# EAGLE design High Current Board (EAGLE 9.2.2)
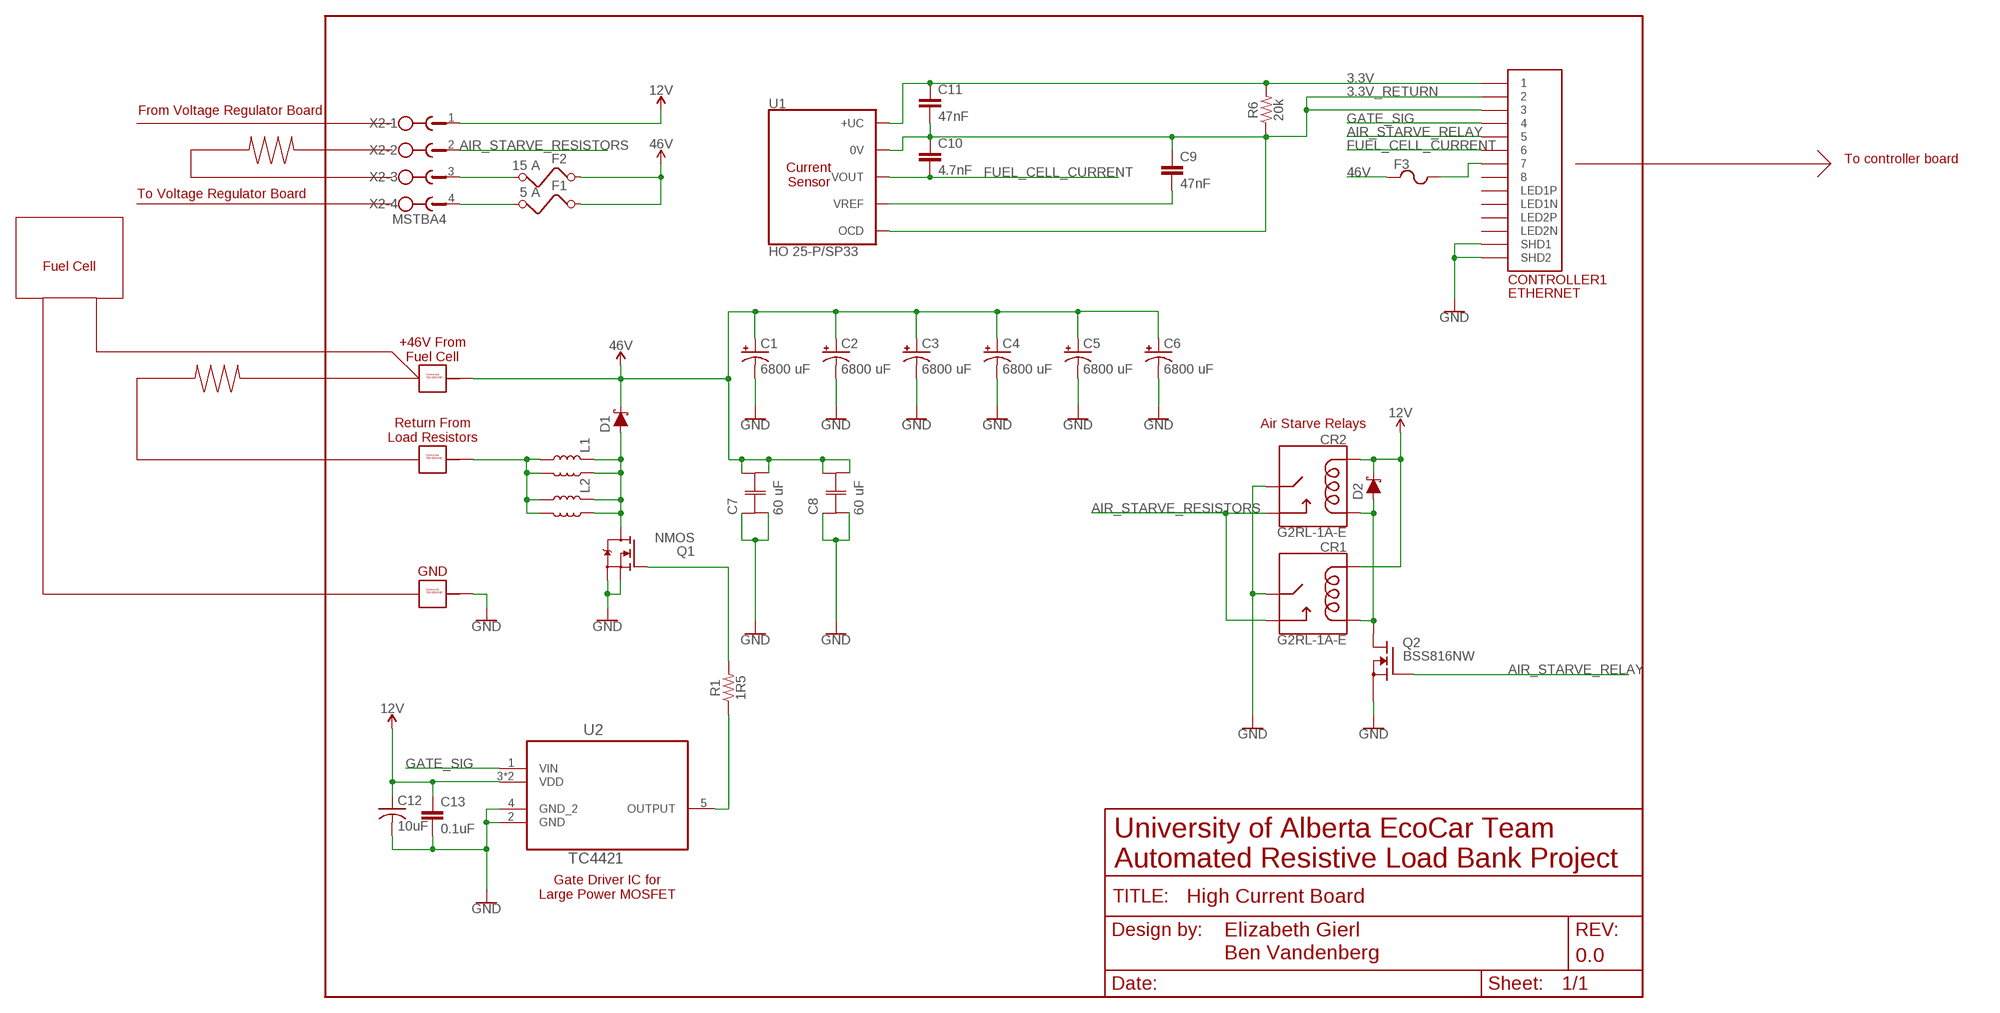
[diagram p0: schematic, sheet 1]

## Parts
C1  6800 uF  C-POL-RADIAL-10MM-35MM  [CPOL-RADIAL-10MM-35MM]
C2  6800 uF  C-POL-RADIAL-10MM-35MM  [CPOL-RADIAL-10MM-35MM]
C3  6800 uF  C-POL-RADIAL-10MM-35MM  [CPOL-RADIAL-10MM-35MM]
C4  6800 uF  C-POL-RADIAL-10MM-35MM  [CPOL-RADIAL-10MM-35MM]
C5  6800 uF  C-POL-RADIAL-10MM-35MM  [CPOL-RADIAL-10MM-35MM]
C6  6800 uF  C-POL-RADIAL-10MM-35MM  [CPOL-RADIAL-10MM-35MM]
C7  60 uF  C4ATDBW5600A30J  [C4A-0(60)]
C8  60 uF  C4ATDBW5600A30J  [C4A-0(60)]
C9  47nF  1.0UF-0805-25V-(+80/-20%)  [0805]
C10  4.7nF  1.0UF-0805-25V-(+80/-20%)  [0805]
C11  47nF  1.0UF-0805-25V-(+80/-20%)  [0805]
C12  10uF  C-USC0603  [C0603]
C13  0.1uF  1.0UF-0805-25V-(+80/-20%)  [0805]
CONTROLLER1  ETHERNET  [A122645-ND]
CR1  G2RL-1A-E  G2RL-1A-E_SPST_RELAY  [G2RL-1A-E_RELAY]
CR2  G2RL-1A-E  G2RL-1A-E_SPST_RELAY  [G2RL-1A-E_RELAY]
D1  VISHAY_VS-243NQ100PBF  [D-67_HALF-PAK]
D2  SOD-123F_SCHOTTKY  [SOD-123F]
F1  5 A  KEYSTONE_ATM_FUSEHOLDER  [KEYSTONE_ATM_FUSEHOLDER]
F2  15 A  KEYSTONE_ATM_FUSEHOLDER  [KEYSTONE_ATM_FUSEHOLDER]
F3  POLYFUSE  [1206]
FC.GND1  732-3204-ND_CONNECTOR  [732-3204-ND]
FC.GND2  732-3204-ND_CONNECTOR  [732-3204-ND]
FC.POS  732-3204-ND_CONNECTOR  [732-3204-ND]
FRAME1  FRAME-LETTERNO_PACKAGE  [DUMMY]
L1  CMX1616Z171B-10  [CMX1616Z171B-10]
L2  CMX1616Z171B-10  [CMX1616Z171B-10]
Q1  NMOS  VISHAY_BIG_MOSFET  [SOT-227]
Q2  BSS816NW  SOT323-NMOS  [SOT-323]
R1  1R5  R_SMD_2512  [SMD_2512]
R6  20k  0.3OHM-0805-1/8W-1%  [0805]
U1  HO 25-P/SP33  LEM_HO_25-P  [LEM_HO_25-P]
U2  TC4421  TC4421A-HORIZONTAL  [TO220-52]
X2  MSTBA4  [MSTBA4]

## Nets
3.3V: C11.1 CONTROLLER1.P$1 R6.2 U1.1(+UC)
3.3V_RETURN: C9.1 C10.1 C11.2 CONTROLLER1.P$2 CONTROLLER1.P$3 R6.1 U1.2(0V) U1.5(OCD)
12V: C12.1 C13.1 CR1.1(COIL1) CR2.1(COIL1) D2.C U2.3(VDD) U2.P$1(VDD) X2.1
46V: C1.+ C2.+ C3.+ C4.+ C5.+ C6.+ C7.3 C7.4 C8.3 C8.4 D1.C F1.L1 F1.L2 F2.L1 F2.L2 F3.1 FC.POS.P$1 FC.POS.P$2 FC.POS.P$3 FC.POS.P$4 FC.POS.P$5 FC.POS.P$6 FC.POS.P$7 FC.POS.P$8 FC.POS.P$9 FC.POS.P$10
AIR_STARVE_RELAY: CONTROLLER1.P$5 Q2.1G(G)
AIR_STARVE_RESISTORS: CR1.4(NO) CR1.5(NO) CR2.4(NO) CR2.5(NO) X2.2
FUEL_CELL_CURRENT: C10.2 CONTROLLER1.P$6 U1.3(VOUT)
GATE_DRIVE: Q1.G Q1.G2(G) R1.P$2
GATE_SIG: CONTROLLER1.P$4 U2.1(VIN)
GND: C1.- C2.- C3.- C4.- C5.- C6.- C7.1 C7.2 C8.1 C8.2 C12.2 C13.2 CONTROLLER1.P$13(SHD1) CONTROLLER1.P$14(SHD2) CR1.3(MAIN) CR1.6(MAIN) CR2.3(MAIN) CR2.6(MAIN) FC.GND2.P$1 FC.GND2.P$2 FC.GND2.P$3 FC.GND2.P$4 FC.GND2.P$5 FC.GND2.P$6 FC.GND2.P$7 FC.GND2.P$8 FC.GND2.P$9 FC.GND2.P$10 Q1.S1(S) Q1.S2(S1) Q1.S3(S) Q1.S4(S1) Q2.2S(S) U2.2(GND) U2.4(GND_2)
N$1: C9.2 U1.4(VREF)
N$2: FC.GND1.P$1 FC.GND1.P$2 FC.GND1.P$3 FC.GND1.P$4 FC.GND1.P$5 FC.GND1.P$6 FC.GND1.P$7 FC.GND1.P$8 FC.GND1.P$9 FC.GND1.P$10 L1.R1(B1) L1.R2(B2) L1.R11(B1) L1.R22(B2) L2.R1(B1) L2.R2(B2) L2.R11(B1) L2.R22(B2)
N$3: CR1.8(COIL2) CR2.8(COIL2) D2.A Q2.3D(D)
N$4: L1.L1(T1) L1.L2(T2) L1.L11(T1) L1.L22(T2) L2.L1(T1) L2.L2(T2) L2.L11(T1) L2.L22(T2) Q1.D Q1.D2(D)
N$5: F2.R1 F2.R2 X2.3
N$6: F1.R1 F1.R2 X2.4
N$7: R1.P$1 U2.5(OUTPUT)
N$8: CONTROLLER1.P$7 F3.2
Unconnected: CONTROLLER1.P$8 CONTROLLER1.P$9(LED1N) CONTROLLER1.P$10(LED1P) CONTROLLER1.P$11(LED2N) CONTROLLER1.P$12(LED2P)

## Notes on the sheet
- From Voltage Regulator Board
- To controller board
- Current
  Sensor
- To Voltage Regulator Board
- Fuel Cell
- +46V From
  Fuel Cell
- Air Starve Relays
- Return From
  Load Resistors
- GND
- University of Alberta EcoCar Team
  Automated Resistive Load Bank Project
- Gate Driver IC for
  Large Power MOSFET
- Elizabeth Gierl

## Library data of the parts
C1-C6 = CustomLibrary:C-POL-RADIAL-10MM-35MM
C7 C8 = CustomLibrary:C4ATDBW5600A30J; MANUFACTURER_PART_NUMBER: C4ATDBW5600A30J; VENDOR: KEMET
C9-C11 C13 = SparkFun-Capacitors:1.0UF: 1µF ceramic capacitors A capacitor is a passive two-terminal electrical component used to store electrical energy temporarily in an electric field.; PROD_ID: CAP-11625; VALUE: 1.0uF
C12 = adafruit:C-US: CAPACITOR, American symbol
CONTROLLER1 = ETHERNET-3:ETHERNET: Ethernet port with 2 leds. digikey number A122645-ND
CR1 CR2 = CustomLibrary:G2RL-1A-E_SPST_RELAY
D1 = CustomLibrary:VISHAY_VS-243NQ100PBF
D2 = CustomLibrary:SOD-123F_SCHOTTKY
F1 F2 = CustomLibrary:KEYSTONE_ATM_FUSEHOLDER; VALUE: ? A
F3 = polyfuse:POLYFUSE: Resistor Basic schematic elements and footprints for 0603, 1206, and PTH resistors.
FC.GND1 FC.GND2 FC.POS = Connector 732-3204:732-3204-ND_CONNECTOR
FRAME1 = SparkFun-Aesthetics:FRAME-LETTER: Schematic Frame - Letter Standard 8.5x11 US Letter frame; DESIGNER: Ben Vandenberg; REV: 0.0; VERSION: v01
L1 L2 = CustomLibrary:CMX1616Z171B-10
Q1 = CustomLibrary:VISHAY_BIG_MOSFET
Q2 = CustomLibrary:SOT323-NMOS
R1 = CustomLibrary:R_SMD_2512
R6 = SparkFun-Resistors:0.3OHM: 0.3Ω resistor A resistor is a passive two-terminal electrical component that implements electrical resistance as a circuit element. Resistors act to reduce current flow, and, at the same time, act to lower voltage levels within circuits. - Wikipedia; PROD_ID: RES-11622; VALUE: 0.3
U1 = CustomLibrary:LEM_HO_25-P
U2 = High Current Board:TC4421A-HORIZONTAL
X2 = con-phoenix-508:MSTBA4: PHOENIX; MF: FARNELL; MPN: 1757268; OC_FARNELL: 3705195; OC_NEWARK: 71C4163

## Board
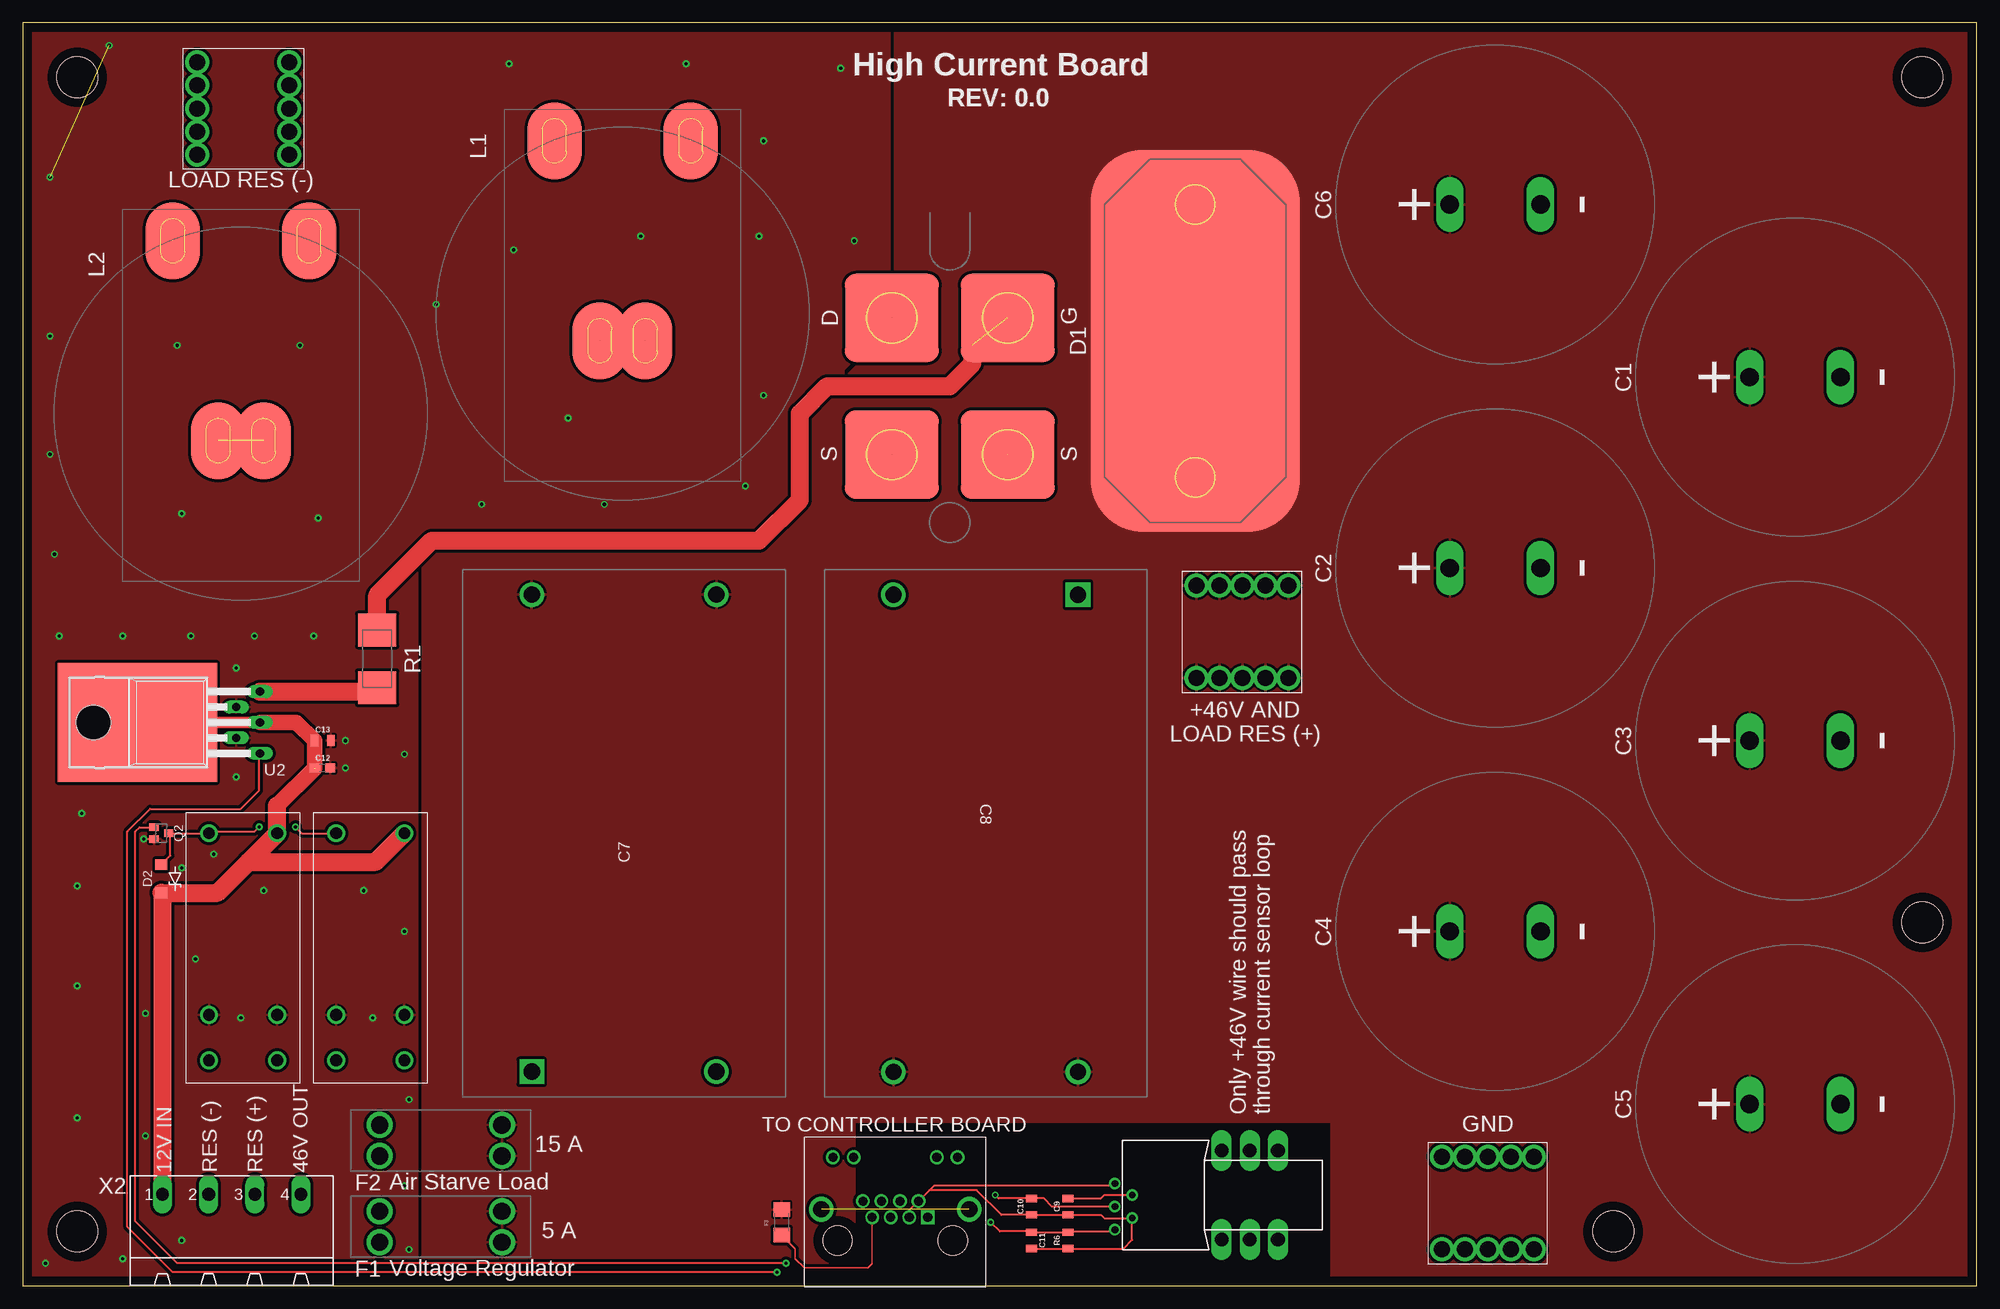
[diagram p1: board, top side]
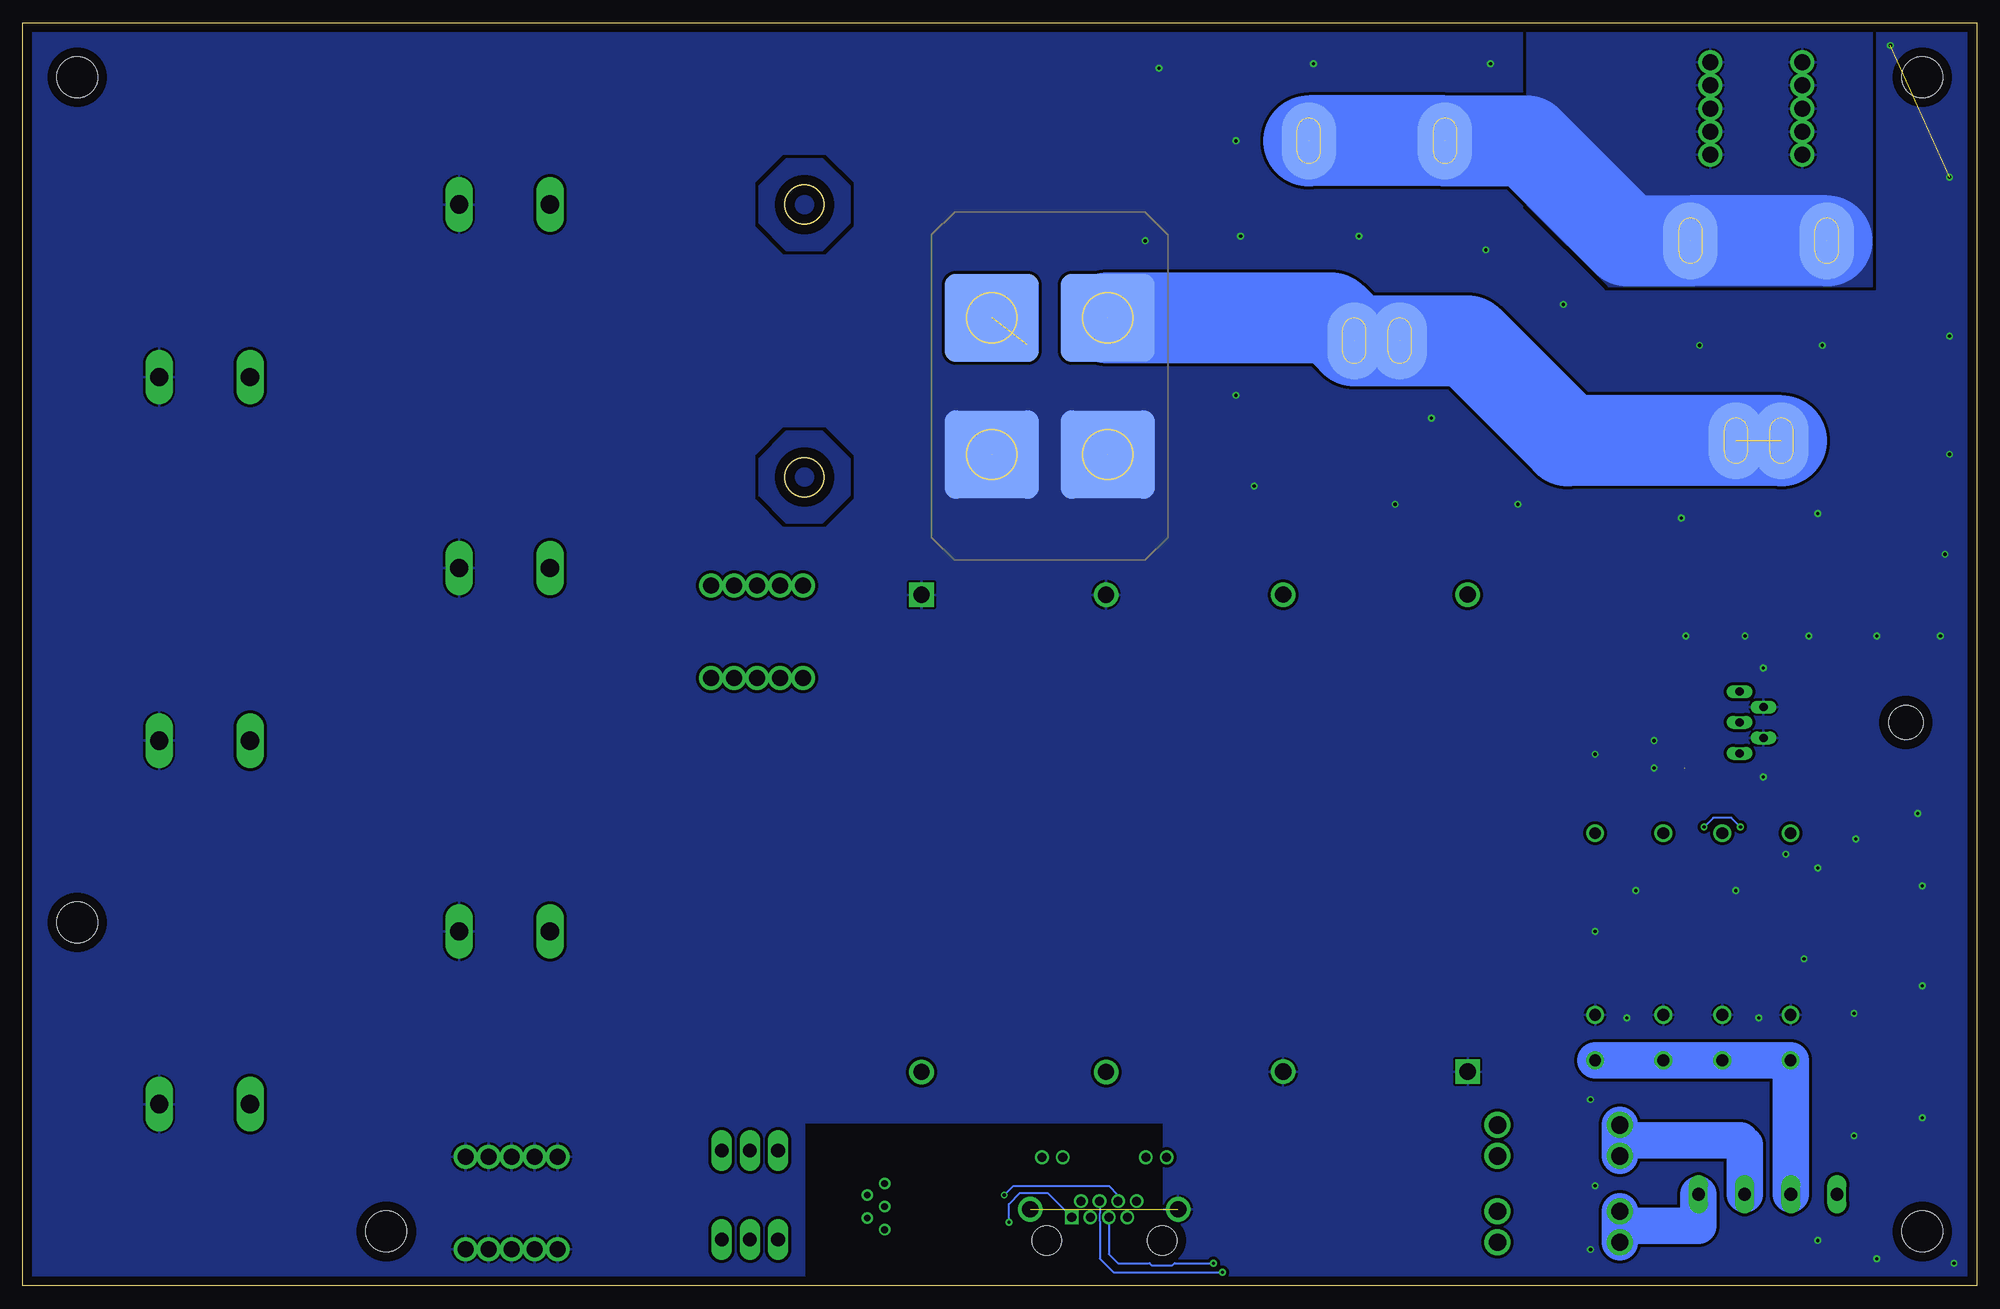
[diagram p2: board, bottom side, seen from below]

Size 215 x 139 mm. Coordinates in mm from the lower left corner, seen from the top.
Outline: 215,139 0,139 0,0 215,0 215,139
Copper layers (1*16): Top 0.035mm / dielectric 1.5mm / Bottom 0.035mm
Design rules "default *": minimum track width 6mil, minimum drill 0.35mm, track to track 13mil, track to pad 13mil, pad to pad 13mil, via to via 24mil, smd to smd 6mil, copper to edge 40mil, drill to drill 4mil, minimum pad ring 10mil, minimum via ring 8mil, stop-mask expansion 4mil, vias tented up to drill 0mil, thermal gap 10mil
Holes 4.5 mm at 209,40 6,6 209,133 6,133 175,6

### Footprints (pad centres in the part's own frame; a part is rotated, then mirrored left to right if it is on the bottom)
CPOL-RADIAL-10MM-35MM = drill 2 long: + 0,5; - 0,-5
C4A-0(60) = drill 1.8 square: 1 -52.5,20.3 | drill 1.8: 2 -52.5,0; 3 0,0; 4 0,20.3
0805 = smd 0.8 x 1.2: 1 -0.9,0; 2 0.9,0
C0603 = smd 1.1 x 1: 1 -0.85,0; 2 0.85,0
A122645-ND = drill 1 square: P$1 3.58,2.54 | drill 1: P$2 2.56,4.32; P$3 1.54,2.54; P$4 0.52,4.32; P$5 -0.5,2.54; P$6 -1.52,4.32; P$7 -2.54,2.54; P$8 -3.56,4.32; P$9 -6.86,9.14; P$10 -4.57,9.14; P$11 4.57,9.14; P$12 6.86,9.14 | drill 1.8: P$13 -8.13,3.43; P$14 8.13,3.43 | hole 3.25: -6.35,0; 6.35,0
G2RL-1A-E_RELAY = drill 1.3: 1 -20,3.75; 3 0,3.75; 4 5,3.75; 5 5,-3.75; 6 0,-3.75; 8 -20,-3.75
D-67_HALF-PAK = smd 42 x 23: C 0,0
SOD-123F = smd 1.15 x 1.3: A 1.55,0; C -1.55,0
KEYSTONE_ATM_FUSEHOLDER = drill 1.905: L1 -6.731,1.702; L2 -6.731,-1.702; R1 6.731,1.702; R2 6.731,-1.702
1206 = smd 1.6 x 1.8: 1 -1.4,0; 2 1.4,0
732-3204-ND = drill 1.76: P$1 -5.08,5.08; P$2 -2.54,5.08; P$3 0,5.08; P$4 2.54,5.08; P$5 5.08,5.08; P$6 5.08,-5.08; P$7 2.54,-5.08; P$8 0,-5.08; P$9 -2.54,-5.08; P$10 -5.08,-5.08
CMX1616Z171B-10 = smd 8.5 x 6 bottom: L1 -22,2.5; L2 -22,-2.5; R1 0,7.5; R2 0,-7.5 | smd 8.5 x 6: L11 -22,2.5; L22 -22,-2.5; R11 0,7.5; R22 0,-7.5
SOT-227 = smd 9.7 x 10.3: D 7.525,6.375; G 7.525,-6.375; S1 -7.525,6.375; S2 -7.525,-6.375 | smd 9.7 x 10.3 bottom: D2 7.525,6.375; G2 7.525,-6.375; S3 -7.525,6.375; S4 -7.525,-6.375
SOT-323 = smd 0.8 x 1: 1G -0.65,-0.8; 2S 0.65,-0.8; 3D 0,0.8
SMD_2512 = smd 3.6 x 4.2: P$1 3.175,0; P$2 -3.175,0
LEM_HO_25-P = drill 0.75: 1 -14.835,-3.81; 2 -12.93,-2.54; 3 -14.835,-1.27; 4 -12.93,0; 5 -14.835,1.27 | drill 1.5 long: P$1 0,4.9; P$2 0,-4.9; P$3 3.1,4.9; P$4 3.1,-4.9; P$5 -3.1,4.9; P$6 -3.1,-4.9
TO220-52 = drill 0.9 long: 1 -3.4,-21.1; 2 -1.7,-18.47; 3 0,-21.1; 4 1.7,-18.47; 5 3.4,-21.1 | smd 13.081 x 17.526: P$1 0,-7.62 | hole 3.8: 0,-2.8
MSTBA4 = drill 1.397 long: 1 -7.62,5.08; 2 -2.54,5.08; 3 2.54,5.08; 4 7.62,5.08

### Placement (x,y rotation side)
C1  195,100 90 top
C2  162,79 90 top
C3  195,60 90 top
C4  162,39 90 top
C5  195,20 90 top
C6  162,119 90 top
C7  76.32,76.07 90 top
C8  95.81,23.55 270 top
C9  115,8.71 90 top
C10  111,8.71 90 top
C11  111,5 270 top
C12  33,57 0 top
C13  33,60 0 top
CONTROLLER1  96,5 0 top
CR1  24.24,29.82 270 top
CR2  38.24,29.82 270 top
D1  129,104 90 top
D2  15.24,44.81 90 top
F1  46,6.5 180 top
F2  46,16 180 top
F3  83.5,7 270 top
FC.GND1  24.25,129.56 270 top
FC.GND2  161.21,9.13 180 top
FC.POS  134.2,71.99 180 top
FRAME1  106,90 0 top
L1  66,126 90 top
L2  24,115 90 top
Q1  102,99 90 top
Q2  15.24,49.81 270 top
R1  39,69 270 top
R6  115,5 90 top
U1  135,10 0 top
U2  5,62 90 top
X2  23,5 0 top

### Tracks (layer width: path | path; a pad name or v marks a point on that pad's centre or on a via)
3.3V  (via drill 0.35)
  Top 0.2: U1.1 119.97,6 115.1,6 R6.2 C11.1 110.9,6 107.5,6 v106.5,7
  Bottom 0.2: v106.5,7 106.5,9 105.27,10.23 102.27,10.23 CONTROLLER1.P$1
3.3V_RETURN
  Top 0.2: C11.2 R6.1 121.1,4.1 122.07,5.07 U1.2 119.02,7.46 118.66,7.81 C9.1 C10.1 107.69,7.81 104.97,10.53 99.77,10.53 | U1.5 119.89,11 100.24,11 99.77,10.53 | 99.77,10.53 CONTROLLER1.P$2 97.54,8.3 CONTROLLER1.P$3
12V  (1 unrouted)
  Top 1.27: U2.3 U2.P$1
  Top 1.7: U2.3 30.1,62 C13.1 32.1,56.95 27.99,52.84
  Top 2: X2.1 15.38,43.12 D2.C 21.44,43.27 24.84,46.66 | 24.84,46.66 CR1.1 27.99,52.84 | 24.84,46.66 38.84,46.66 CR2.1
46V
  pour Bottom: 127,124 131,124 134,121 134,117 131,114 127,114 124,117 124,121
  pour Bottom: 127,94 131,94 134,91 134,87 131,84 127,84 124,87 124,91
  pour Top (rank 2): 215,0 144,0 144,18 91.5,18 91.5,0 44,0 44,81 45,82 81,82 85.5,86.5 85.5,95.5 89,99 89.5,99 96,105.5 96,139 215,139
AIR_STARVE_RELAY  (via drill 0.35)
  Top 0.2: Q2.1G 12.87,50.47 12.4,50 12.4,7.1 17,2.5 v84,2.5
  Bottom 0.2: CONTROLLER1.P$5 95.5,3.5 94.5,2.5 91.03,2.5 90.78,2.26 88.52,2.26 88.27,2.5 v84,2.5
AIR_STARVE_RESISTORS
  Bottom 4: CR2.4 CR2.5 CR1.4 CR1.5 20.49,10.11 X2.2
FUEL_CELL_CURRENT  (via drill 0.35)
  Top 0.2: U1.3 113.27,8.73 112.39,9.61 C10.2 107.39,9.61 v107,10
  Bottom 0.2: v107,10 106,11 95.5,11 94.48,9.98 CONTROLLER1.P$6
GATE_DRIVE  (2 unrouted)
  Top 2: R1.P$2 39,76 45,82 81,82 85.5,86.5 85.5,96 88.5,99 102,99 104.5,101.5 104.5,103.55 104.28,103.78
GATE_SIG  (via drill 0.35)
  Top 0.2: v83,1.5 16.5,1.5 11.5,6.5 11.5,50 14,52.5 24,52.5 26,54.5 26,58.5 U2.1
  Bottom 0.2: CONTROLLER1.P$4 96.5,9.3 96.5,7.96 96.51,7.96 96.51,7.12 96.5,7.12 96.5,3 95,1.5 v83,1.5
GND  (via drill 0.35)  (4 unrouted)
  Top 0.2: v13.3,49.2 14.4,49.2 Q2.2S
  other vias: 42,11 42.5,20.5 42.5,4 17.5,5 11,3 2.5,2.5 13.5,16.5 13.5,30 6,18.5 6,33 19,36 24,29.5 38.5,29.5 42,39 37.5,43.5 26.5,43.5 6,44 6.5,52 17.5,46 21,47.5 23.5,56 35.5,57 35.5,60 42,58.5 23.5,68 4,71.5 11,71.5 18.5,71.5 25.5,71.5 32,71.5 3.5,80.5 17.5,85 32.5,84.5 50.5,86 64,86 79.5,88 60,95.5 81.5,98 3,91.5 3,104.5 17,103.5 30.5,103.5 45.5,108 54,114 68,115.5 81,115.5 91.5,115 81.5,126 90,134 73,134.5 53.5,134.5 9.5,136.5 3,122
  pour Bottom (rank 2): 0,0 0,139 215,139 215,0 129,0 129,18 89.5,18 89.5,0
  pour Top (rank 3): 0,139 215,139 215,0 144,0 144,18 91.5,18 91.5,0 0,0
N$1
  Top 0.2: C9.2 118.61,9.61 119,10 U1.4
N$2  (4 unrouted)
  Bottom 10: L1.R22 L1.R1 49.5,126 38.5,115 L2.R22 L2.R11
  pour Bottom: 11.5,110 11.5,139 49.5,139 49.5,119 40.5,110
N$3  (via drill 0.35)
  Top 0.2: D2.A 16.24,47.37 16.24,49.81 Q2.3D CR1.8 20.68,50 25.5,50 v26,50.5 | v30,50.5 30.68,49.81 CR2.8
  Bottom 0.2: v30,50.5 29,51.5 27,51.5 v26,50.5
N$4  (6 unrouted)
  Bottom 10: Q1.D2 71.03,106.53 L1.L22 L1.L1 56,104 45,93 L2.L1
N$5
  Bottom 4: X2.3 25.54,15.54 26,16 39,16 39.27,16.27 | 39.27,16.27 F2.R2 | F2.R1 39.27,16.27
N$6
  Bottom 0.2: F1.R2 39.27,7.27 39,7 37.81,7 37.4,6.6
  Bottom 4: F1.R2 F1.R1 | X2.4 30.62,6.6 37.4,6.6
N$7
  Top 2: U2.5 38.58,65.4 R1.P$1
N$8
  Top 0.152: F3.2 85,4.1 85,3 86,2 93,2 93.46,2.46 CONTROLLER1.P$7

### Text on the board
tPlace: High Current Board | REV: 0.0 | LOAD RES (-) | +46V AND / LOAD RES (+) | Only +46V wire should pass / through current sensor loop | TO CONTROLLER BOARD | GND | 12V IN | RES (-) | RES (+) | 46V OUT | Air Starve Load | Voltage Regulator